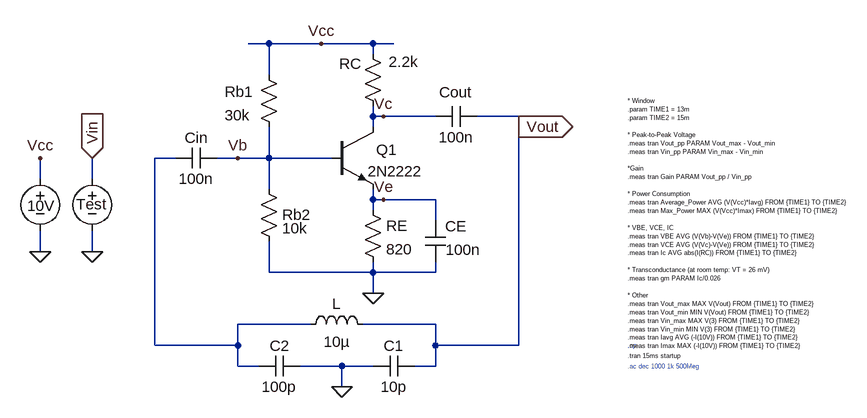
[diagram p0: schematic colpitts.asc]
colpitts.asc, the LTspice schematic file:
Version 4
SHEET 1 2180 1844
WIRE 272 -304 240 -304
WIRE 352 -304 272 -304
WIRE 432 -304 352 -304
WIRE 464 -304 432 -304
WIRE 432 -288 432 -304
WIRE 272 -256 272 -304
WIRE 432 -192 432 -208
WIRE 448 -192 432 -192
WIRE 528 -192 448 -192
WIRE 656 -192 592 -192
WIRE 432 -176 432 -192
WIRE 656 -176 656 -192
WIRE 128 -128 96 -128
WIRE 224 -128 192 -128
WIRE 272 -128 272 -176
WIRE 272 -128 224 -128
WIRE 368 -128 272 -128
WIRE -80 -96 -80 -128
WIRE 0 -96 0 -128
WIRE 272 -80 272 -128
WIRE 432 -64 432 -80
WIRE 448 -64 432 -64
WIRE 528 -64 448 -64
WIRE 432 -48 432 -64
WIRE 528 -32 528 -64
WIRE -80 16 -80 -16
WIRE 0 16 0 -16
WIRE 272 48 272 0
WIRE 432 48 432 32
WIRE 432 48 272 48
WIRE 528 48 528 32
WIRE 528 48 432 48
WIRE 432 80 432 48
WIRE 336 128 224 128
WIRE 528 128 416 128
WIRE 96 160 96 -128
WIRE 224 160 224 128
WIRE 224 160 96 160
WIRE 528 160 528 128
WIRE 656 160 656 -176
WIRE 656 160 528 160
WIRE 224 192 224 160
WIRE 256 192 224 192
WIRE 384 192 320 192
WIRE 432 192 384 192
WIRE 528 192 528 160
WIRE 528 192 496 192
WIRE 384 224 384 192
FLAG -80 16 0
FLAG 432 80 0
FLAG 352 -304 Vcc
FLAG 224 -128 Vb
FLAG 448 -192 Vc
FLAG 448 -64 Ve
FLAG 0 -128 Vin
IOPIN 0 -128 In
FLAG 0 16 0
FLAG -80 -128 Vcc
FLAG 384 224 0
FLAG 656 -176 Vout
IOPIN 656 -176 Out
DATAFLAG 352 -128 "Ib(Q1)"
DATAFLAG 432 -240 "Ic(Q1)"
DATAFLAG 544 -64 "-Ie(Q1)"
DATAFLAG 272 -304 ""
DATAFLAG 432 -304 ""
DATAFLAG 432 -192 ""
DATAFLAG 272 -112 ""
DATAFLAG 432 -64 ""
DATAFLAG 416 48 ""
DATAFLAG 368 192 ""
DATAFLAG 656 -192 ""
DATAFLAG 96 0 ""
SYMBOL voltage -80 -112 M0
WINDOW 0 -23 57 Left 2
WINDOW 3 -2225 -1755 Invisible 2
WINDOW 123 0 0 Left 0
WINDOW 39 0 0 Left 0
SYMATTR InstName 10V
SYMATTR Value 10
SYMBOL npn 368 -176 R0
WINDOW 0 69 35 Left 2
SYMATTR InstName Q1
SYMATTR Value 2N2222
SYMBOL cap 592 -208 R90
WINDOW 0 -6 33 VBottom 2
WINDOW 3 32 32 VTop 2
SYMATTR InstName Cout
SYMATTR Value 100n
SYMBOL cap 512 -32 R0
WINDOW 0 31 9 Left 2
WINDOW 3 32 45 Left 2
SYMATTR InstName CE
SYMATTR Value 100n
SYMBOL res 256 -272 R0
WINDOW 0 -52 42 Left 2
WINDOW 3 -52 78 Left 2
SYMATTR InstName Rb1
SYMATTR Value 30k
SYMBOL res 416 -304 R0
WINDOW 0 -36 31 Left 2
WINDOW 3 40 28 Left 2
SYMATTR InstName RC
SYMATTR Value 2.2k
SYMBOL res 256 -96 R0
WINDOW 0 36 55 Left 2
SYMATTR InstName Rb2
SYMATTR Value 10k
SYMBOL res 416 -64 R0
SYMATTR InstName RE
SYMATTR Value 820
SYMBOL voltage 0 -112 R0
WINDOW 0 -25 55 Left 2
WINDOW 3 -94 121 Left 2
WINDOW 39 0 0 Left 0
SYMATTR InstName Test
SYMATTR Value ""
SYMATTR Value2 AC 1
SYMBOL cap 192 -144 R90
WINDOW 0 0 32 VBottom 2
WINDOW 3 32 32 VTop 2
SYMATTR InstName Cin
SYMATTR Value 100n
SYMBOL Ind 320 144 R270
WINDOW 0 32 56 VTop 2
WINDOW 3 5 56 VBottom 2
SYMATTR InstName L
SYMATTR Value 10µ
SYMBOL Cap 320 176 R90
WINDOW 0 0 32 VBottom 2
WINDOW 3 32 32 VTop 2
SYMATTR InstName C2
SYMATTR Value 100p
SYMBOL Cap 496 176 R90
WINDOW 0 0 32 VBottom 2
WINDOW 3 32 32 VTop 2
SYMATTR InstName C1
SYMATTR Value 10p
TEXT 824 176 Left 0 !.tran 15ms startup
TEXT 824 160 Left 0 ;.op
TEXT 824 192 Left 0 ;.ac dec 1000 1k 500Meg
TEXT 824 -216 Left 0 !* Window\n.param TIME1 = 13m\n.param TIME2 = 15m\n \n* Peak-to-Peak Voltage\n.meas tran Vout_pp PARAM Vout_max - Vout_min\n.meas tran Vin_pp PARAM Vin_max - Vin_min\n \n*Gain\n.meas tran Gain PARAM Vout_pp / Vin_pp\n \n* Power Consumption      \n.meas tran Average_Power AVG (V(Vcc)*Iavg) FROM {TIME1} TO {TIME2}\n.meas tran Max_Power MAX (V(Vcc)*Imax) FROM {TIME1} TO {TIME2}\n \n* VBE, VCE, IC\n.meas tran VBE AVG (V(Vb)-V(Ve)) FROM {TIME1} TO {TIME2}\n.meas tran VCE AVG (V(Vc)-V(Ve)) FROM {TIME1} TO {TIME2}\n.meas tran Ic AVG abs(I(RC)) FROM {TIME1} TO {TIME2}   \n \n* Transconductance (at room temp: VT = 26 mV)\n.meas tran gm PARAM Ic/0.026\n \n* Other\n.meas tran Vout_max MAX V(Vout) FROM {TIME1} TO {TIME2}\n.meas tran Vout_min MIN V(Vout) FROM {TIME1} TO {TIME2}\n.meas tran Vin_max MAX V(3) FROM {TIME1} TO {TIME2}\n.meas tran Vin_min MIN V(3) FROM {TIME1} TO {TIME2}\n.meas tran Iavg AVG (-I(10V)) FROM {TIME1} TO {TIME2}\n.meas tran Imax MAX (-I(10V)) FROM {TIME1} TO {TIME2}

The netlist it stands for:
* colpitts.asc
V§10V Vcc 0 10
Q1 Vc Vb Ve 0 2N2222
Cout Vout Vc 100n
CE Ve 0 100n
Rb1 Vcc Vb 30k
RC Vcc Vc 2.2k
Rb2 Vb 0 10k
RE Ve 0 820
V§Test Vin 0 AC 1
Cin Vb N001 100n
L N001 Vout 10µ
C2 0 N001 100p
C1 Vout 0 10p
.model NPN NPN
.model PNP PNP
.lib standard.bjt
.tran 15ms startup
* .op
* .ac dec 1000 1k 500Meg
* Window
.param TIME1 = 13m
.param TIME2 = 15m
* Peak-to-Peak Voltage
.meas tran Vout_pp PARAM Vout_max - Vout_min
.meas tran Vin_pp PARAM Vin_max - Vin_min
*Gain
.meas tran Gain PARAM Vout_pp / Vin_pp
* Power Consumption
.meas tran Average_Power AVG (V(Vcc)*Iavg) FROM {TIME1} TO {TIME2}
.meas tran Max_Power MAX (V(Vcc)*Imax) FROM {TIME1} TO {TIME2}
* VBE, VCE, IC
.meas tran VBE AVG (V(Vb)-V(Ve)) FROM {TIME1} TO {TIME2}
.meas tran VCE AVG (V(Vc)-V(Ve)) FROM {TIME1} TO {TIME2}
.meas tran Ic AVG abs(I(RC)) FROM {TIME1} TO {TIME2}
* Transconductance (at room temp: VT = 26 mV)
.meas tran gm PARAM Ic/0.026
* Other
.meas tran Vout_max MAX V(Vout) FROM {TIME1} TO {TIME2}
.meas tran Vout_min MIN V(Vout) FROM {TIME1} TO {TIME2}
.meas tran Vin_max MAX V(3) FROM {TIME1} TO {TIME2}
.meas tran Vin_min MIN V(3) FROM {TIME1} TO {TIME2}
.meas tran Iavg AVG (-I(10V)) FROM {TIME1} TO {TIME2}
.meas tran Imax MAX (-I(10V)) FROM {TIME1} TO {TIME2}
.backanno
.end